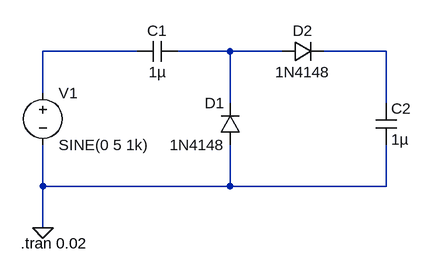
[diagram p0: schematic A02 - Simulacao.asc]
A02 - Simulacao.asc, the LTspice schematic file:
Version 4
SHEET 1 880 680
WIRE 192 32 48 32
WIRE 336 32 256 32
WIRE 416 32 336 32
WIRE 576 32 480 32
WIRE 48 96 48 32
WIRE 336 112 336 32
WIRE 576 112 576 32
WIRE 48 240 48 176
WIRE 336 240 336 176
WIRE 336 240 48 240
WIRE 576 240 576 176
WIRE 576 240 336 240
WIRE 48 304 48 240
FLAG 48 304 0
SYMBOL cap 256 16 R90
WINDOW 0 0 32 VBottom 2
WINDOW 3 32 32 VTop 2
SYMATTR InstName C1
SYMATTR Value 1µ
SYMBOL diode 416 48 R270
WINDOW 0 32 32 VTop 2
WINDOW 3 0 32 VBottom 2
SYMATTR InstName D2
SYMATTR Value 1N4148
SYMBOL voltage 48 80 R0
WINDOW 123 0 0 Left 0
WINDOW 39 0 0 Left 0
SYMATTR InstName V1
SYMATTR Value SINE(0 5 1k)
SYMBOL diode 352 176 R180
WINDOW 0 24 64 Left 2
WINDOW 3 24 0 Left 2
SYMATTR InstName D1
SYMATTR Value 1N4148
SYMBOL cap 560 112 R0
SYMATTR InstName C2
SYMATTR Value 1µ
TEXT 14 328 Left 2 !.tran 0.02

The netlist it stands for:
* A02 - Simulacao.asc
C1 N002 N001 1µ
D2 N002 N003 1N4148
V1 N001 0 SINE(0 5 1k)
D1 0 N002 1N4148
C2 N003 0 1µ
.model D D
.lib standard.dio
.tran 0.02
.backanno
.end